# EasyEDA Pro project ProProject_caotai_ctrl_v2.epro

# Schematic schematic1
Create Date: 2023-12-30; Page Name: P1; Project Name: caotai_ctrl_v2; Schematic Name: schematic1; Update Date: 2024-03-09; Company: 嘉立创EDA; Page Size: A4; Version: V1.0
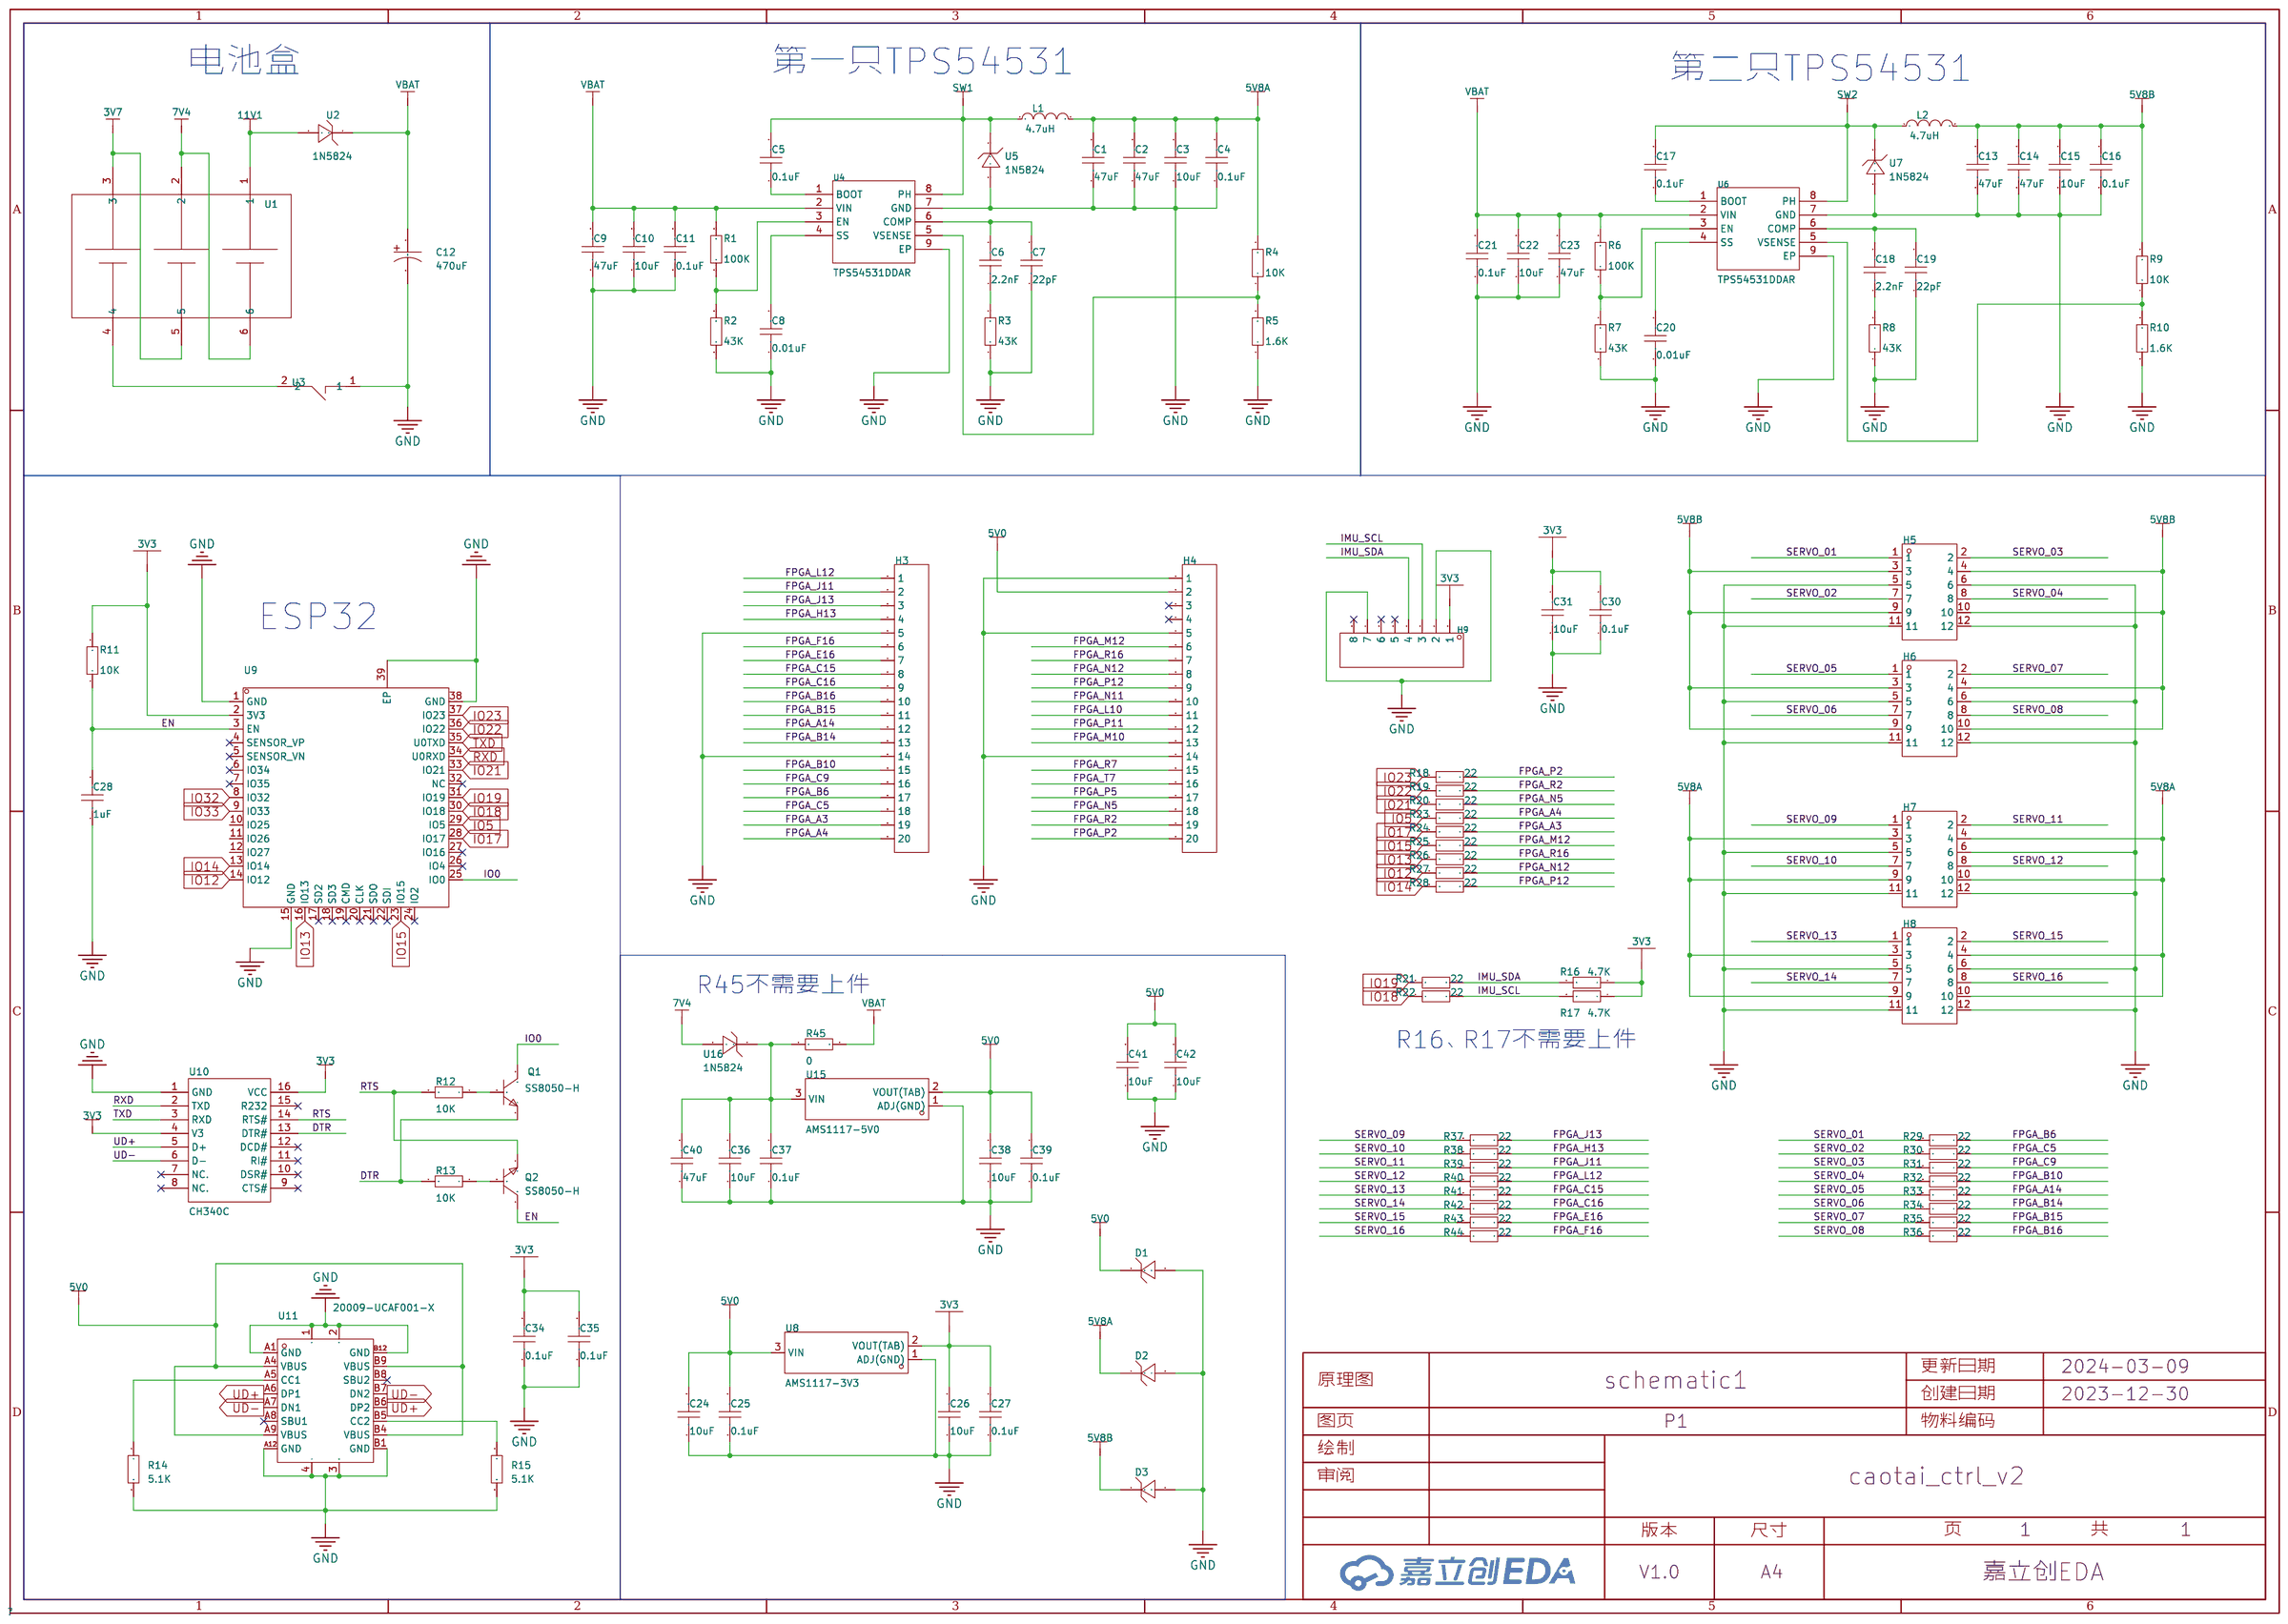
[diagram p0: schematic sheet]

## Parts
C1  47uF  [C0603]
C2  47uF  [C0603]
C3  10uF  [C0603]
C4  0.1uF  [C0603]
C5  0.1uF  [C0603]
C6  2.2nF  [C0603]
C7  22pF  [C0603]
C8  0.01uF  [C0603]
C9  47uF  [C0603]
C10  10uF  [C0603]
C11  0.1uF  [C0603]
C12  470uF  [CAP-TH_BD10.0-P5.00-D1.0-FD]
C13  47uF  [C0603]
C14  47uF  [C0603]
C15  10uF  [C0603]
C16  0.1uF  [C0603]
C17  0.1uF  [C0603]
C18  2.2nF  [C0603]
C19  22pF  [C0603]
C20  0.01uF  [C0603]
C21  0.1uF  [C0603]
C22  10uF  [C0603]
C23  47uF  [C0603]
C24  10uF  [C0603]
C25  0.1uF  [C0603]
C26  10uF  [C0603]
C27  0.1uF  [C0603]
C28  1uF  [C0603]
C30  0.1uF  [C0603]
C31  10uF  [C0603]
C34  0.1uF  [C0603]
C35  0.1uF  [C0603]
C36  10uF  [C0603]
C37  0.1uF  [C0603]
C38  10uF  [C0603]
C39  0.1uF  [C0603]
C40  47uF  [C0603]
C41  10uF  [C0603]
C42  10uF  [C0603]
D1  SMBJ24CD-M3/I  [SMB_L4.6-W3.6-LS5.3-RD]
D2  SMBJ24CD-M3/I  [SMB_L4.6-W3.6-LS5.3-RD]
D3  SMBJ24CD-M3/I  [SMB_L4.6-W3.6-LS5.3-RD]
H3  -  [HDR-TH_20P-P2.54-V-F]
H4  -  [HDR-TH_20P-P2.54-V-F]
H5  -  [HDR-TH_12P-P2.54-V-M-R2-C6-S2.54]
H6  -  [HDR-TH_12P-P2.54-V-M-R2-C6-S2.54]
H7  -  [HDR-TH_12P-P2.54-V-M-R2-C6-S2.54]
H8  -  [HDR-TH_12P-P2.54-V-M-R2-C6-S2.54]
H9  -  [HDR-TH_8P-P2.54-V-M]
L1  4.7uH  [IND-SMD_L10.2-W10.0_MS104R]
L2  4.7uH  [IND-SMD_L10.2-W10.0_MS104R]
Q1  SS8050-H  [SOT-23-3_L2.9-W1.3-P1.90-LS2.4-BR]
Q2  SS8050-H  [SOT-23-3_L2.9-W1.3-P1.90-LS2.4-BR]
R1  100K  [R0603]
R2  43K  [R0603]
R3  43K  [R0603]
R4  10K  [R0603]
R5  1.6K  [R0603]
R6  100K  [R0603]
R7  43K  [R0603]
R8  43K  [R0603]
R9  10K  [R0603]
R10  1.6K  [R0603]
R11  10K  [R0603]
R12  10K  [R0603]
R13  10K  [R0603]
R14  5.1K  [R0603]
R15  5.1K  [R0603]
R16  4.7K  [R0603]
R17  4.7K  [R0603]
R18  22  [R0603]
R19  22  [R0603]
R20  22  [R0603]
R21  22  [R0603]
R22  22  [R0603]
R23  22  [R0603]
R24  22  [R0603]
R25  22  [R0603]
R26  22  [R0603]
R27  22  [R0603]
R28  22  [R0603]
R29  22  [R0603]
R30  22  [R0603]
R31  22  [R0603]
R32  22  [R0603]
R33  22  [R0603]
R34  22  [R0603]
R35  22  [R0603]
R36  22  [R0603]
R37  22  [R0603]
R38  22  [R0603]
R39  22  [R0603]
R40  22  [R0603]
R41  22  [R0603]
R42  22  [R0603]
R43  22  [R0603]
R44  22  [R0603]
R45  0  [R0603]
U1  -  [3节18650插针]
U2  1N5824  [SMB_L4.4-W3.6-LS5.2-RD]
U3  KCD11船型开关  [SW-TH_KCD11]
U4  TPS54531DDAR  [SOIC-8_L5.0-W4.0-P1.27-LS6.0-BL-EP2.0]
U5  1N5824  [SMB_L4.4-W3.6-LS5.2-RD]
U6  TPS54531DDAR  [SOIC-8_L5.0-W4.0-P1.27-LS6.0-BL-EP2.0]
U7  1N5824  [SMB_L4.4-W3.6-LS5.2-RD]
U8  AMS1117-3V3  [SOT-89-3_L4.5-W2.5-P1.50-LS4.1-BL]
U9  -  [wirelm-smd_esp32-s]
U10  CH340C  [SOP-16_L10.0-W3.9-P1.27-LS6.0-BL]
U11  20009-UCAF001-X  [TYPE-C-SMD_20009-UCAF001-X]
U15  AMS1117-5V0  [SOT-89-3_L4.5-W2.5-P1.50-LS4.1-BL]
U16  1N5824  [SMB_L4.4-W3.6-LS5.2-RD]

## Library data of the parts
C1-C11 C13-C28 C30 C31 C34-C42 = CAP_0603: Supplier Footprint: 0603; Check: false
C12 = NXB25VB470M10*16_5.0TP: 容值:470uF;精度:±20%;额定电压:25V;; LCSC Part Name: 470uF ±20% 25V; Supplier Part: C371244; Manufacturer: SAMYOUNG(韩国三莹); Supplier Footprint: 插件,D10xL16mm; JLCPCB Part Class: 扩展库; Datasheet: https://atta.szlcsc.com/upload/public/pdf/source/20190227/C371244_FA85FFEFC2961227CF12E3CCE8C34A7D.pdf; Supplier: LCSC; Tolerance: ±20%; Rated Voltage: 25V; φD: 10mm; L: 16mm; Lead Spacing: 5mm; Lifetime @ Temp: 4000hrs@105℃; Check: false
D1-D3 = SMBJ24CD-M3/I: 极性:双向;反向截止电压(Vrwm):24V;击穿电压(最小值):27.1V;峰值脉冲电流(Ipp)@10/1000μs:-;最大钳位电压:38.4V;峰值脉冲功率(Ppp)@10/1000μs:600W;; LCSC Part Name: 双向 Vrwm:24V 600W; Supplier Part: C335775; Manufacturer: VISHAY(威世); Supplier Footprint: SMBJ; JLCPCB Part Class: 扩展库; Datasheet: https://atta.szlcsc.com/upload/public/pdf/source/20181122/C335775_149570DB14F3A9C7607A2247C4D338E7.pdf; Supplier: LCSC; Polarity: 双向; Reverse Stand-Off Voltage (Vrwm): 24V; Breakdown Voltage (Min): 27.1V; Maximum Clamping Voltage: 38.4V; Peak Pulse Power Dissipation (Ppp)@10/1000μs: 600W; Check: false
H3 H4 = HDR-F_2.54_1x20P: Supplier Part: C50984; Supplier Footprint: 插件; Check: false
H5-H8 = HDR-M_2.54_2x6: Supplier Part: C30734; Supplier Footprint: 插件,P=2.54mm; Check: false
H9 = HDR-M_2.54_1x8P: Supplier Part: C124381; Supplier Footprint: 插件; Check: false
L1 L2 = CDRH104_2: Supplier Part: C9900021916; Supplier Footprint: IND-SMD-2P; JLCPCB Part Class: 扩展库; Supplier: LCSC; Check: false
Q1 Q2 = SS8050-H: 晶体管类型:NPN;集射极击穿电压(Vceo):25V;集电极电流(Ic):1.5A;功率(Pd):300mW;集电极截止电流(Icbo):100nA;集电极-发射极饱和电压(VCE(sat)@Ic,Ib):500mV@800mA,80mA;直流电流增益(hFE@Ic,Vce):200@100mA,1V;特征频率(fT):100MHz;工作温度:-55~+150@(Tj);; LCSC Part Name: NPN25V1.5A; Supplier Part: C699255; Manufacturer: YANGJIE(扬杰); Supplier Footprint: SOT-23-3L; JLCPCB Part Class: 扩展库; Datasheet: https://atta.szlcsc.com/upload/public/pdf/source/20200709/C699255_98BD284548BE18129453A2CE3A1F2C22.pdf; Supplier: LCSC; Transistor Type: NPN; Collector-Emitter Breakdown Voltage (Vceo): 25V; Collector Current (Ic): 1.5A; Power Dissipation (Pd): 300mW; Collector Cut-Off Current (Icbo): 100nA; Collector-Emitter Saturation Voltage (VCE(sat)@Ic,Ib): 500mV@800mA,80mA; DC Current Gain (hFE@Ic,Vce): 200@100mA,1V; Transition Frequency (fT): 100MHz; Operating Temperature: -55~+150@(Tj); Check: false
R1-R45 = Res_0603: Supplier Footprint: 0603; Check: false
U1 = 3节18650电池盒插针: Check: false
U2 U5 U7 U16 = 1N5824-SMB: Supplier Part: C9900006358; Supplier Footprint: SMB; JLCPCB Part Class: 扩展库; Datasheet: https://atta.szlcsc.comnull; Supplier: LCSC; Check: false
U3 = KCD11船型开关: Supplier Part: C9900000872; Supplier Footprint: SW-TH; JLCPCB Part Class: 扩展库; Datasheet: https://atta.szlcsc.comnull; Supplier: LCSC; Check: false
U4 U6 = TPS54531DDAR: 功能类型:降压型;输出类型:可调;输入电压:3.5V~28V;输出电压:800mV~26.04V;输出电流(最大值):5A;; LCSC Part Name: 降压型 输入3.5V~28V 输出800mV~26.04V 5A; Supplier Part: C50605; Manufacturer: TI(德州仪器); Supplier Footprint: SOP-8-EP; JLCPCB Part Class: 扩展库; Datasheet: https://www.ti.com/cn/lit/gpn/tps54531; Supplier: LCSC; Function: 降压型; Synchronous Rectification: 否; Output Type: 可调; Number of Outputs: 1; Topology: 降压式; Input Voltage: 3.5V~28V; Output Voltage: 800mV~26.04V; Output Current (Max): 5A; Switching Frequency: 570kHz; Operating Temperature: -40℃~+85℃@(TA); Check: false
U8 U15 = AMS1117-ADJS: Supplier Part: C3014296; Manufacturer: UMW(广东友台半导体); Supplier Footprint: SOT-89-3; JLCPCB Part Class: 扩展库; Datasheet: https://atta.szlcsc.com/upload/public/pdf/source/20181218/C351450_92F5FFD1D089F5E1CE84AA29B13D48DD.pdf; Supplier: LCSC; Check: false
U9 = esp32-s: LCSC Part Name: ESP32-S; Supplier Part: C277944; Manufacturer: Ai-Thinker(安信可); Manufacturer Part: ESP32-S; Supplier Footprint: SMDModule; JLCPCB Part Class: ExtendedPart; Datasheet: https://atta.szlcsc.com/upload/public/pdf/source/20211217/F4BEA33E732D6002D10DAED85BBCB52B.pdf; Supplier: LCSC; Check: false
U10 = CH340C: 类型:Transceiver;协议类别:USB2.0;驱动器/接收器数:-;数据速率:2Mbps;; Supplier Part: C84681; Manufacturer: WCH(南京沁恒); Supplier Footprint: SOP-16_150mil; JLCPCB Part Class: 扩展库; Datasheet: https://atta.szlcsc.com/upload/public/pdf/source/20200819/C84681_ADBED554CE321879DBD6B1D06488689C.pdf; Supplier: LCSC; Type: Transceiver; Protocol: USB2.0; Data Rate: 2Mbps; Supply Voltage: 3.3V,5V; Check: false
U11 = 20009-UCAF001-X: LCSC Part Name: TYPEC; Supplier Part: C3148200; Manufacturer: MINTRON(明硕); Supplier Footprint: SMD; JLCPCB Part Class: 扩展库; Datasheet: https://atta.szlcsc.com/upload/public/pdf/source/20220705/4C04992B6F70FB490BC74B4779796E6C.pdf; Supplier: LCSC; Check: false

## Nets
3V3: C26.2 C27.2 C30.2 C31.1 C34.2 C35.2 H9.1 R11.2 R16.1 R17.1 U8.2(VOUT(TAB)) U9.2(3V3) U10.4(V3) U10.16(VCC)
3V7: U1.3 U1.5
5V0: C24.2 C25.2 C38.2 C39.2 C41.2 C42.2 D1.1(K) H4.2 U8.3(VIN) U11.A4(VBUS) U11.A9(VBUS) U11.B4(VBUS) U11.B9(VBUS) U15.2(VOUT(TAB))
5V8A: C1.2 C2.2 C3.2 C4.2 D2.1(K) H7.3 H7.4 H7.9 H7.10 H8.3 H8.4 H8.9 H8.10 L1.2 R4.2
5V8B: C13.2 C14.2 C15.2 C16.2 D3.1(K) H5.3 H5.4 H5.9 H5.10 H6.3 H6.4 H6.9 H6.10 L2.2 R9.2
7V4: U1.2 U1.6 U16.2(A)
11V1: U1.1 U2.2(A)
GND: C1.1 C2.1 C3.1 C4.1 C7.1 C8.1 C9.1 C10.1 C11.1 C12.2 C13.1 C14.1 C15.1 C16.1 C19.1 C20.1 C21.1 C22.1 C23.1 C24.1 C25.1 C26.1 C27.1 C28.1 C30.1 C31.2 C34.1 C35.1 C36.1 C37.1 C38.1 C39.1 C40.1 C41.1 C42.1 D1.2(A) D2.2(A) D3.2(A) H3.5 H3.14 H4.1 H4.5 H4.14 H5.5 H5.6 H5.11 H5.12 H6.5 H6.6 H6.11 H6.12 H7.5 H7.6 H7.11 H7.12 H8.5 H8.6 H8.11 H8.12 H9.2 H9.7 R2.1 R3.1 R5.1 R7.1 R8.1 R10.1 R14.2 R15.2 U3.1 U4.7(GND) U4.9(EP) U5.2(A) U6.7(GND) U6.9(EP) U7.2(A) U8.1(ADJ(GND)) U9.1(GND) U9.15(GND) U9.38(GND) U9.39(EP) U10.1(GND) U11.1 U11.2 U11.3 U11.4 U11.A1(GND) U11.A12(GND) U11.B1(GND) U11.B12(GND) U15.1(ADJ(GND))
VBAT: C9.2 C10.2 C11.2 C12.1 C21.2 C22.2 C23.2 R1.2 R6.2 R45.1 U2.1(C) U4.2(VIN) U6.2(VIN)
DTR: Q1.2(E) R13.2 U10.13(DTR#)
EN: C28.2 Q2.3(C) R11.1 U9.3(EN)
FPGA_A3: H3.19 R24.1
FPGA_A4: H3.20 R23.1
FPGA_A14: H3.12 R33.1
FPGA_B6: H3.17 R29.1
FPGA_B10: H3.15 R32.1
FPGA_B14: H3.13 R34.1
FPGA_B15: H3.11 R35.1
FPGA_B16: H3.10 R36.1
FPGA_C5: H3.18 R30.1
FPGA_C9: H3.16 R31.1
FPGA_C15: H3.8 R41.1
FPGA_C16: H3.9 R42.1
FPGA_E16: H3.7 R43.1
FPGA_F16: H3.6 R44.1
FPGA_H13: H3.4 R38.1
FPGA_J11: H3.2 R39.1
FPGA_J13: H3.3 R37.1
FPGA_L10: H4.11
FPGA_L12: H3.1 R40.1
FPGA_M10: H4.13
FPGA_M12: H4.6 R25.1
FPGA_N5: H4.18 R20.1
FPGA_N11: H4.10
FPGA_N12: H4.8 R27.1
FPGA_P2: H4.20 R18.1
FPGA_P5: H4.17
FPGA_P11: H4.12
FPGA_P12: H4.9 R28.1
FPGA_R2: H4.19 R19.1
FPGA_R7: H4.15
FPGA_R16: H4.7 R26.1
FPGA_T7: H4.16
IMU_SCL: H9.3 R17.2 R22.1
IMU_SDA: H9.4 R16.2 R21.1
IO0: Q1.3(C) U9.25(IO0)
IO5: R23.2 U9.29(IO5)
IO12: R27.2 U9.14(IO12)
IO13: R26.2 U9.16(IO13)
IO14: R28.2 U9.13(IO14)
IO15: R25.2 U9.23(IO15)
IO17: R24.2 U9.28(IO17)
IO18: R22.2 U9.30(IO18)
IO19: R21.2 U9.31(IO19)
IO21: R20.2 U9.33(IO21)
IO22: R19.2 U9.36(IO22)
IO23: R18.2 U9.37(IO23)
IO32: U9.8(IO32)
IO33: U9.9(IO33)
RTS: Q2.2(E) R12.2 U10.14(RTS#)
RXD: U9.34(U0RXD) U10.2(TXD)
SERVO_01: H5.1 R29.2
SERVO_02: H5.7 R30.2
SERVO_03: H5.2 R31.2
SERVO_04: H5.8 R32.2
SERVO_05: H6.1 R33.2
SERVO_06: H6.7 R34.2
SERVO_07: H6.2 R35.2
SERVO_08: H6.8 R36.2
SERVO_09: H7.1 R37.2
SERVO_10: H7.7 R38.2
SERVO_11: H7.2 R39.2
SERVO_12: H7.8 R40.2
SERVO_13: H8.1 R41.2
SERVO_14: H8.7 R42.2
SERVO_15: H8.2 R43.2
SERVO_16: H8.8 R44.2
SW1: C5.2 L1.1 U4.8(PH) U5.1(C)
SW2: C17.2 L2.1 U6.8(PH) U7.1(C)
TXD: U9.35(U0TXD) U10.3(RXD)
UD+: U10.5(D+) U11.A6(DP1) U11.B6(DP2)
UD-: U10.6(D-) U11.A7(DN1) U11.B7(DN2)
$1N584: C5.1 U4.1(BOOT)
$1N915: R1.1 R2.2 U4.3(EN)
$1N926: C8.2 U4.4(SS)
$1N1045: C6.2 C7.2 U4.6(COMP)
$1N1051: C6.1 R3.2
$1N1135: R4.1 R5.2 U4.5(VSENSE)
$1N2594: C17.1 U6.1(BOOT)
$1N2596: R6.1 R7.2 U6.3(EN)
$1N2597: C20.2 U6.4(SS)
$1N2600: C18.2 C19.2 U6.6(COMP)
$1N2601: C18.1 R8.2
$1N2603: R9.1 R10.2 U6.5(VSENSE)
$1N3982: Q1.1(B) R12.1
$1N4008: Q2.1(B) R13.1
$1N4343: R14.1 U11.A5(CC1)
$1N4350: R15.1 U11.B5(CC2)
$1N29279: U1.4 U3.2
$1N31260: C36.2 C37.2 C40.2 R45.2 U15.3(VIN) U16.1(C)

Not connected (* = marked no-connect by the designer): H4 3* 4*; H9 5* 6* 8*; U9 4(SENSOR_VP)* 5(SENSOR_VN)* 6(IO34)* 7(IO35)* 10(IO25) 11(IO26) 12(IO27) 17(SD2)* 18(SD3)* 19(CMD)* 20(CLK)* 21(SDO)* 22(SDI)* 24(IO2)* 26(IO4)* 27(IO16)* 32(NC)*; U10 7(NC.)* 8(NC.)* 9(CTS#)* 10(DSR#)* 11(RI#)* 12(DCD#)* 15(R232)*; U11 A8(SBU1)* B8(SBU2)*

## Notes on the sheet
- 电池盒
- 第一只TPS54531
- 第二只TPS54531
- ESP32
- R45不需要上件
- R16、R17不需要上件

# Board PCB1
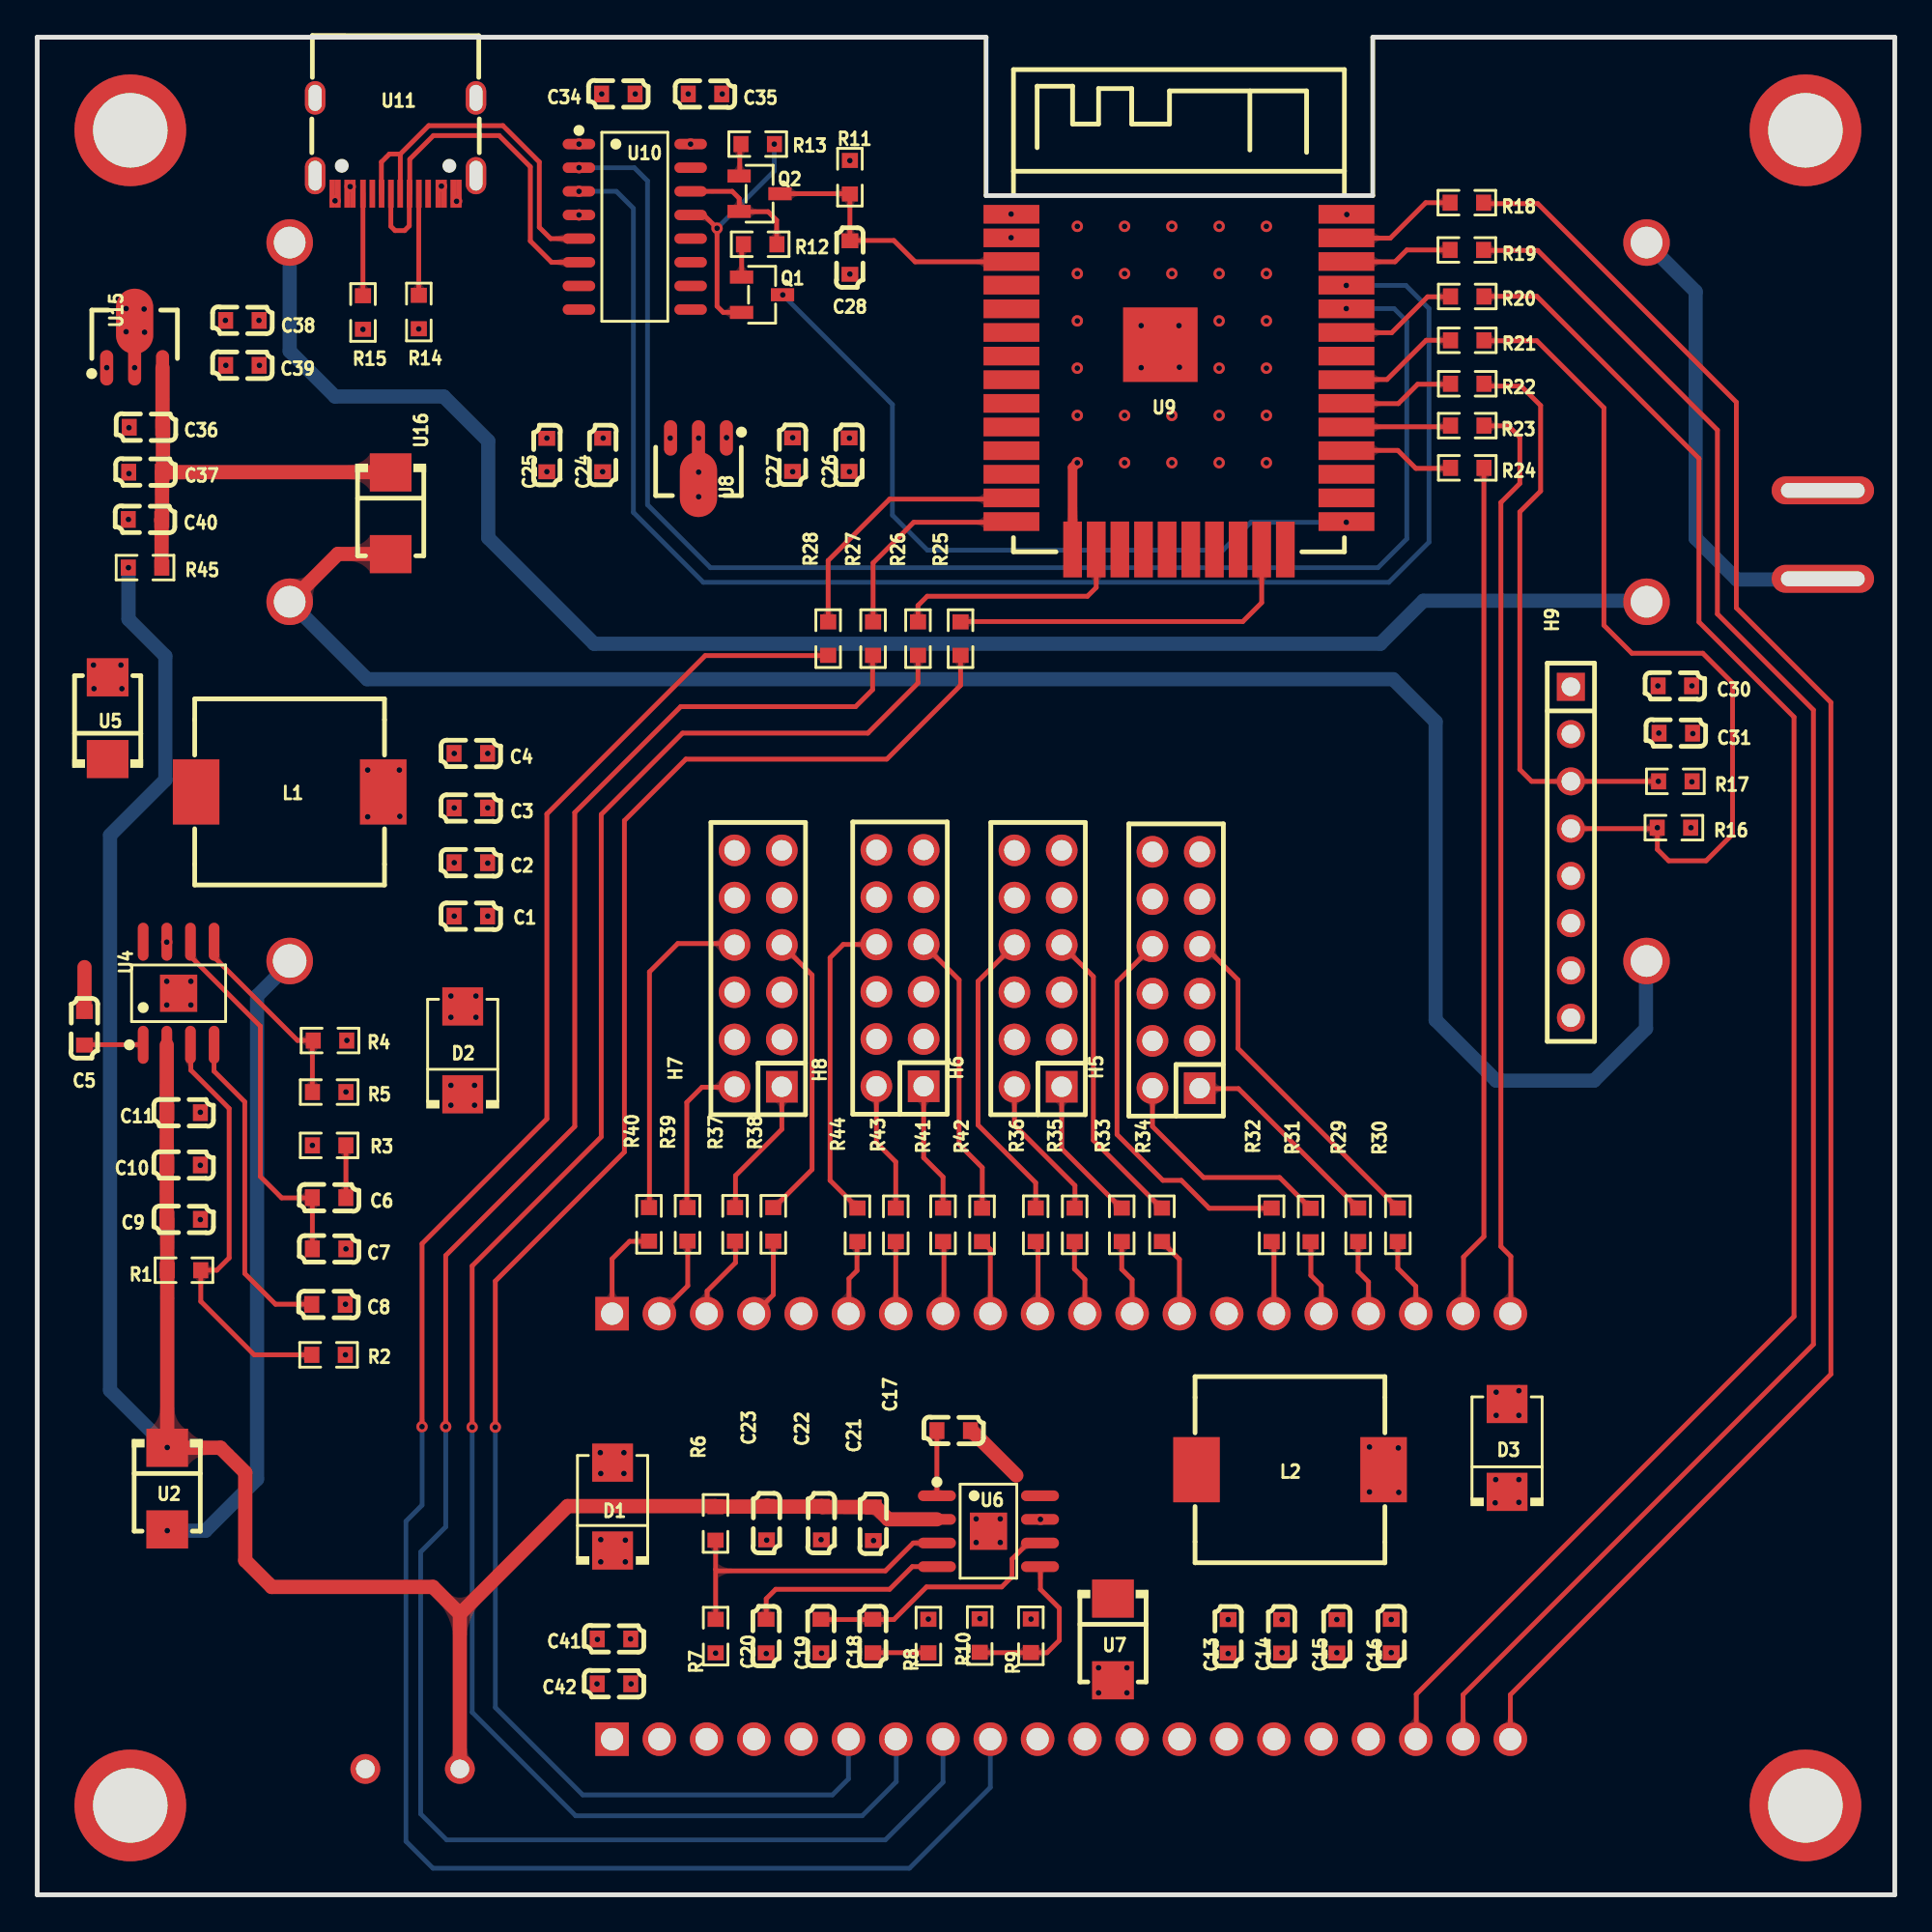
[diagram p1: board, top side]
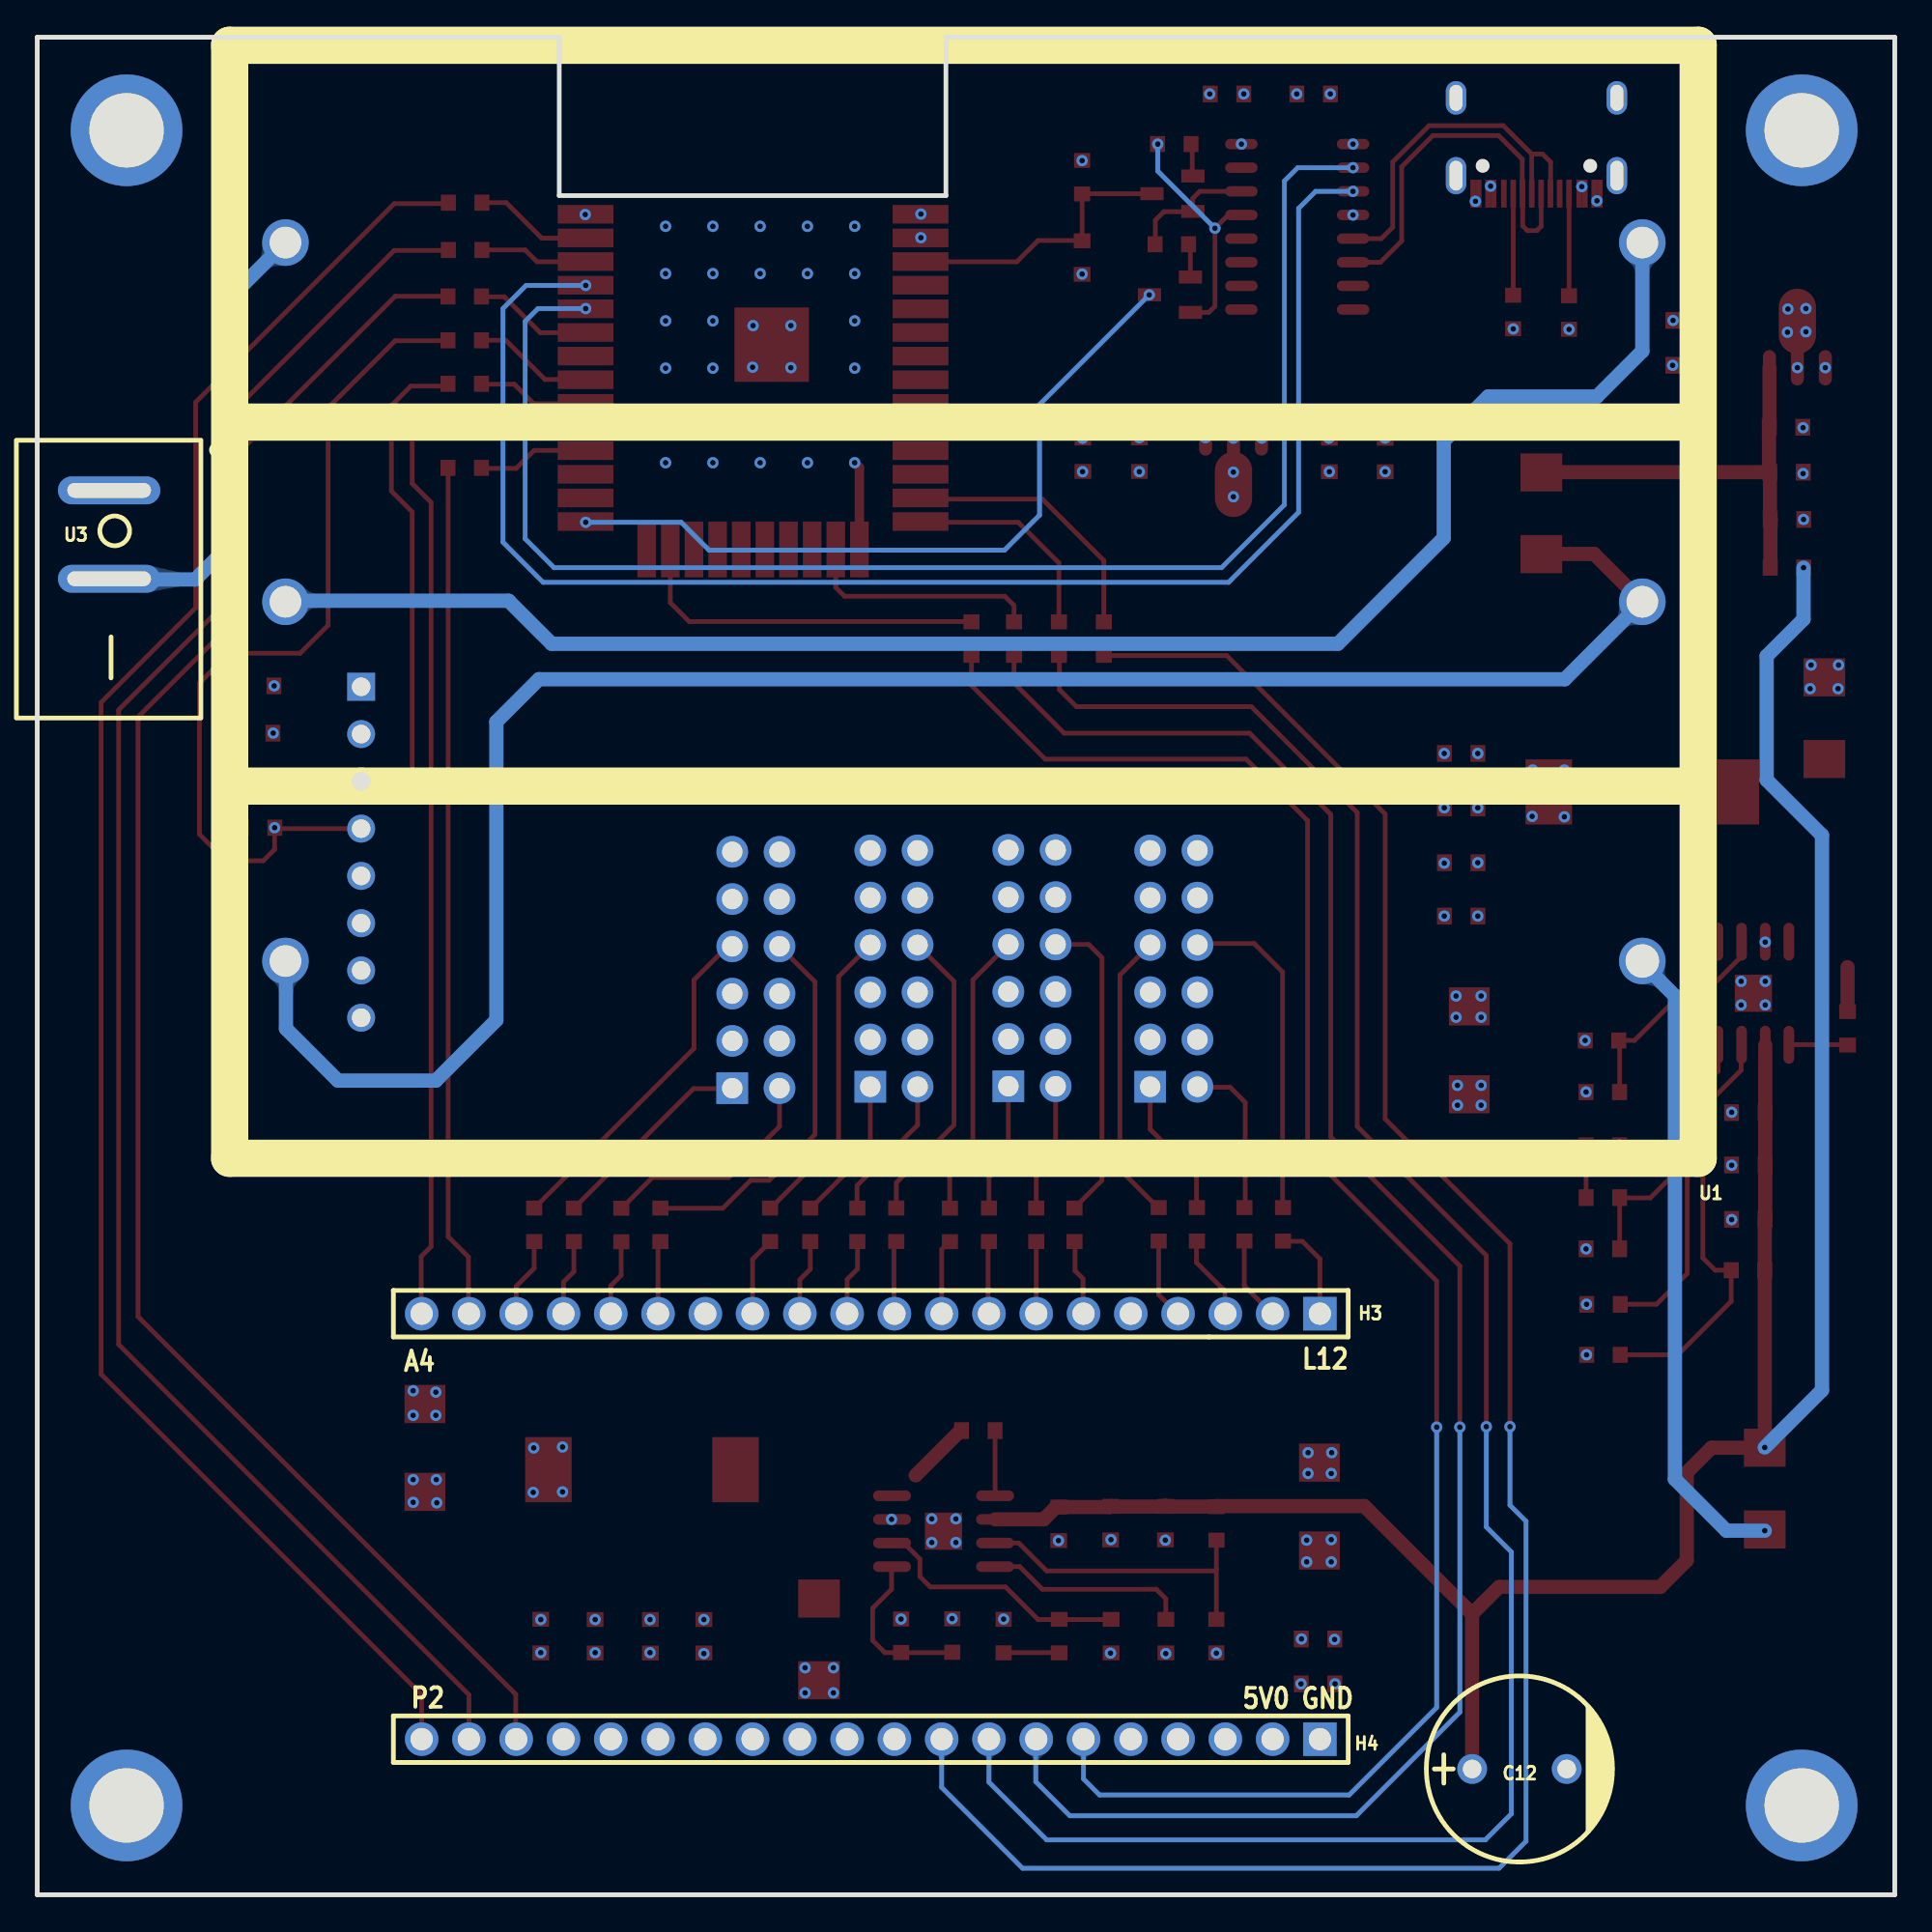
[diagram p2: board, bottom side, seen from below]

Outline 99.8 x 99.8 mm; copper layers: Top Layer, GND, POWER, Bottom Layer. Coordinates in mm from the lower left corner of the outline.
Outline path: 0,99.8 50.98,99.8 50.98,91.29 71.75,91.29 71.75,99.8 99.8,99.8 99.8,0 0,0 0,99.8
Stack: Top Layer 0.035mm 外层铜厚1oz / Dielectric1 0.2104mm 7628 RC49% 8.6mil / GND 0.0152mm 内层铜厚 / Dielectric2 1.065mm 1.1mm H/HOZ 含铜 / POWER 0.0152mm 内层铜厚 / Dielectric3 0.2104mm 7628 RC49% 8.6mil / Bottom Layer 0.035mm 外层铜厚1oz

## Design rules (mm)
template: 自定义配置
spacing copperThickness1oz (default): track to track 0.229, other pairs 0.152 to 0.508
spacing copperThickness2oz: track to track 0.203, other pairs 0.152 to 0.3
track width copperThickness1oz (default): min 0.127, default 0.254, max 2.54
track width copperThickness2oz: min 0.203, default 0.254, max 2.54
track width power_line: min 0.762, default 0.762, max 0.762
differential pair differentialPair (default): width min 0.127, default 0.254, max 2.54; gap min 0.152, default 0.152
via viaSize (default): diameter min 0.5, default 0.61, max 10; hole min 0.3, default 0.305, max 6.299
net VBAT uses power_line
net 5V8A uses power_line
net 11V1 uses power_line
net 7V4 uses power_line
net 3V7 uses power_line
net 5V8B uses power_line
net 5V0 uses power_line
net SW1 uses power_line
net SW2 uses power_line

## Placement (name value [footprint] x y rotation side)
C1  47uF  [C0603]  23.3 52.58 180 top
C2  47uF  [C0603]  23.3 55.45 180 top
C3  10uF  [C0603]  23.3 58.39 180 top
C4  0.1uF  [C0603]  23.3 61.32 180 top
C5  0.1uF  [C0603]  2.54 46.55 90 top
C6  2.2nF  [C0603]  15.68 37.45 180 top
C7  22pF  [C0603]  15.68 34.7 180 top
C8  0.01uF  [C0603]  15.65 31.72 180 top
C9  47uF  [C0603]  7.87 36.29 180 top
C10  10uF  [C0603]  7.87 39.21 180 top
C11  0.1uF  [C0603]  7.87 42.02 180 top
C12  470uF  [CAP-TH_BD10.0-P5.00-D1.0-FD]  20.17 6.76 180 bottom
C13  47uF  [C0603]  63.98 13.89 90 top
C14  47uF  [C0603]  66.85 13.89 90 top
C15  10uF  [C0603]  69.83 13.89 90 top
C16  0.1uF  [C0603]  72.75 13.9 90 top
C17  0.1uF  [C0603]  49.24 24.94 0 top
C18  2.2nF  [C0603]  44.9 13.9 90 top
C19  22pF  [C0603]  42.1 13.9 90 top
C20  0.01uF  [C0603]  39.16 13.9 90 top
C21  0.1uF  [C0603]  44.92 19.93 90 top
C22  10uF  [C0603]  42.13 19.97 90 top
C23  47uF  [C0603]  39.19 19.97 90 top
C24  10uF  [C0603]  30.38 77.36 270 top
C25  0.1uF  [C0603]  27.38 77.35 270 top
C26  10uF  [C0603]  43.62 77.37 90 top
C27  0.1uF  [C0603]  40.58 77.37 90 top
C28  1uF  [C0603]  43.66 87.96 90 top
C30  0.1uF  [C0603]  87.99 64.95 180 top
C31  10uF  [C0603]  88.04 62.41 0 top
C34  0.1uF  [C0603]  31.22 96.75 0 top
C35  0.1uF  [C0603]  35.88 96.75 180 top
C36  10uF  [C0603]  5.84 78.85 0 top
C37  0.1uF  [C0603]  5.82 76.43 0 top
C38  10uF  [C0603]  11.02 84.59 0 top
C39  0.1uF  [C0603]  11.02 82.17 0 top
C40  47uF  [C0603]  5.79 73.89 0 top
C41  10uF  [C0603]  30.99 13.75 0 top
C42  10uF  [C0603]  30.99 11.33 0 top
D1  SMBJ24CD-M3/I  [SMB_L4.6-W3.6-LS5.3-RD]  30.91 20.86 90 top
D2  SMBJ24CD-M3/I  [SMB_L4.6-W3.6-LS5.3-RD]  22.86 45.37 90 top
D3  SMBJ24CD-M3/I  [SMB_L4.6-W3.6-LS5.3-RD]  78.97 24.01 90 top
H3  -  [HDR-TH_20P-P2.54-V-F]  55.02 31.22 0 bottom
H4  -  [HDR-TH_20P-P2.54-V-F]  55.02 8.36 0 bottom
H5  -  [HDR-TH_12P-P2.54-V-M-R2-C6-S2.54]  61.19 49.69 90 top
H6  -  [HDR-TH_12P-P2.54-V-M-R2-C6-S2.54]  53.77 49.76 90 top
H7  -  [HDR-TH_12P-P2.54-V-M-R2-C6-S2.54]  38.74 49.76 90 top
H8  -  [HDR-TH_12P-P2.54-V-M-R2-C6-S2.54]  46.35 49.79 90 top
H9  -  [HDR-TH_8P-P2.54-V-M]  82.4 56.01 270 top
L1  4.7uH  [IND-SMD_L10.2-W10.0_MS104R]  13.56 59.25 0 top
L2  4.7uH  [IND-SMD_L10.2-W10.0_MS104R]  67.31 22.84 0 top
NOREF  -  [Pad_e74]  95 4.8 0 top
NOREF#2  -  [Pad_e73]  5 4.8 0 top
NOREF#3  -  [Pad_e72]  95 94.8 0 top
NOREF#4  -  [Pad_e68]  5 94.8 0 top
Q1  SS8050-H  [SOT-23-3_L2.9-W1.3-P1.90-LS2.4-BR]  38.94 85.96 180 top
Q2  SS8050-H  [SOT-23-3_L2.9-W1.3-P1.90-LS2.4-BR]  38.81 91.39 180 top
R1  100K  [R0603]  7.88 33.56 180 top
R2  43K  [R0603]  15.65 29.01 180 top
R3  43K  [R0603]  15.69 40.26 0 top
R4  10K  [R0603]  15.73 45.9 0 top
R5  1.6K  [R0603]  15.69 43.13 180 top
R6  100K  [R0603]  36.44 19.95 90 top
R7  43K  [R0603]  36.45 13.9 90 top
R8  43K  [R0603]  47.88 13.9 270 top
R9  10K  [R0603]  53.39 13.92 90 top
R10  1.6K  [R0603]  50.64 13.93 270 top
R11  10K  [R0603]  43.66 92.28 90 top
R12  10K  [R0603]  38.84 88.68 0 top
R13  10K  [R0603]  38.71 94.06 0 top
R14  5.1K  [R0603]  20.5 85.04 270 top
R15  5.1K  [R0603]  17.5 85.01 270 top
R16  4.7K  [R0603]  87.94 57.33 180 top
R17  4.7K  [R0603]  88.01 59.82 180 top
R18  22  [R0603]  76.81 90.91 180 top
R19  22  [R0603]  76.81 88.37 180 top
R20  22  [R0603]  76.83 85.87 180 top
R21  22  [R0603]  76.83 83.52 180 top
R22  22  [R0603]  76.83 81.18 180 top
R23  22  [R0603]  76.83 78.93 180 top
R24  22  [R0603]  76.83 76.66 180 top
R25  22  [R0603]  49.61 67.49 90 top
R26  22  [R0603]  47.32 67.49 90 top
R27  22  [R0603]  44.91 67.49 90 top
R28  22  [R0603]  42.49 67.49 90 top
R29  22  [R0603]  70.97 36 90 top
R30  22  [R0603]  73.1 36 90 top
R31  22  [R0603]  68.42 35.99 90 top
R32  22  [R0603]  66.32 36 90 top
R33  22  [R0603]  58.27 36 90 top
R34  22  [R0603]  60.43 36 90 top
R35  22  [R0603]  55.74 36 90 top
R36  22  [R0603]  53.65 36 90 top
R37  22  [R0603]  37.49 36.02 90 top
R38  22  [R0603]  39.55 36.02 90 top
R39  22  [R0603]  34.94 36.02 90 top
R40  22  [R0603]  32.87 36.02 90 top
R41  22  [R0603]  48.67 36 90 top
R42  22  [R0603]  50.76 35.99 90 top
R43  22  [R0603]  46.13 36 90 top
R44  22  [R0603]  44.07 36 90 top
R45  0  [R0603]  5.79 71.31 0 top
U1  -  [3节18650插针]  13.56 50.17 0 bottom
U2  1N5824  [SMB_L4.4-W3.6-LS5.2-RD]  6.98 21.82 270 top
U3  KCD11船型开关  [SW-TH_KCD11]  95.94 73.08 270 bottom
U4  TPS54531DDAR  [SOIC-8_L5.0-W4.0-P1.27-LS6.0-BL-EP2.0]  7.6 48.44 0 top
U5  1N5824  [SMB_L4.4-W3.6-LS5.2-RD]  3.78 63.21 90 top
U6  TPS54531DDAR  [SOIC-8_L5.0-W4.0-P1.27-LS6.0-BL-EP2.0]  51.11 19.53 270 top
U7  1N5824  [SMB_L4.4-W3.6-LS5.2-RD]  57.8 13.72 270 top
U8  AMS1117-3V3  [SOT-89-3_L4.5-W2.5-P1.50-LS4.1-BL]  35.53 77.02 180 top
U9  -  [wirelm-smd_esp32-s]  61.34 81.28 0 top
U10  CH340C  [SOP-16_L10.0-W3.9-P1.27-LS6.0-BL]  32.11 89.61 270 top
U11  20009-UCAF001-X  [TYPE-C-SMD_20009-UCAF001-X]  19.25 93.97 180 top
U15  AMS1117-5V0  [SOT-89-3_L4.5-W2.5-P1.50-LS4.1-BL]  5.23 83.29 0 top
U16  1N5824  [SMB_L4.4-W3.6-LS5.2-RD]  18.99 74.22 270 top

## Footprints (pads in the part's own frame, mm; a bottom-side part is the same pattern mirrored in y, then rotated)
3节18650插针
  round 2.5 hole 1.8x1.7: 1(0,0)
  round 2.5 hole 1.7: 2(0,-19.3) 3(0,-38.6) 4(72.9,-38.6) 5(72.9,-19.3) 6(72.9,0)
C0603
  rect 0.8x0.9 smd: 1(-0.9,0) 2(0.9,0)
CAP-TH_BD10.0-P5.00-D1.0-FD
  round 1.6 hole 1: 1(-2.54,0) 2(2.54,0)
HDR-TH_8P-P2.54-V-M
  rect 1.5x1.5 hole 1: 1(-8.89,0)
  round 1.5 hole 1: 2(-6.35,0) 3(-3.81,0) 4(-1.27,0) 5(1.27,0) 6(3.81,0) 7(6.35,0) 8(8.89,0)
HDR-TH_12P-P2.54-V-M-R2-C6-S2.54
  rect 1.7x1.7 hole 1.1: 1(-6.35,-1.27)
  round 1.7 hole 1.1: 2(-6.35,1.27) 3(-3.81,-1.27) 4(-3.81,1.27) 5(-1.27,-1.27) 6(-1.27,1.27) 7(1.27,-1.27) 8(1.27,1.27) 9(3.81,-1.27) 10(3.81,1.27) 11(6.35,-1.27) 12(6.35,1.27)
HDR-TH_20P-P2.54-V-F
  rect 1.8x1.8 hole 1.2: 1(-24.13,0)
  round 1.8 hole 1.2: 2(-21.59,0) 3(-19.05,0) 4(-16.51,0) 5(-13.97,0) 6(-11.43,0) 7(-8.89,0) 8(-6.35,0) 9(-3.81,0) 10(-1.27,0) 11(1.27,0) 12(3.81,0) 13(6.35,0) 14(8.89,0) 15(11.43,0) 16(13.97,0) 17(16.51,0) 18(19.05,0) 19(21.59,0) 20(24.13,0)
IND-SMD_L10.2-W10.0_MS104R
  rect 2.5x3.5 smd: 1(-5.026,0) 2(5.026,0)
Pad_e68
  round 6 hole 4: 40(0,0)
Pad_e72
  round 6 hole 4: 40(0,0)
Pad_e73
  round 6 hole 4: 40(0,0)
Pad_e74
  round 6 hole 4: 40(0,0)
R0603
  rect 0.806x0.864 smd: 1(-0.9,0) 2(0.9,0)
SMB_L4.4-W3.6-LS5.2-RD
  rect 2.047x2.241 smd: 1(-2.195,0) 2(2.195,0)
SMB_L4.6-W3.6-LS5.3-RD
  rect 2.047x2.192 smd: 1(-2.361,0) 2(2.361,0)
SOIC-8_L5.0-W4.0-P1.27-LS6.0-BL-EP2.0
  oval 0.574x2.038 smd: 1(-1.905,-2.769) 2(-0.635,-2.769) 3(0.635,-2.769) 4(1.905,-2.769) 5(1.905,2.769) 6(0.635,2.769) 7(-0.635,2.769) 8(-1.905,2.769)
  rect 2x2 smd: 9(0,0)
SOP-16_L10.0-W3.9-P1.27-LS6.0-BL
  oval 0.56x1.745 smd: 1(-4.445,-3) 2(-3.175,-3) 3(-1.905,-3) 4(-0.635,-3) 5(0.635,-3) 6(1.905,-3) 7(3.175,-3) 8(4.445,-3) 9(4.445,3) 10(3.175,3) 11(1.905,3) 12(0.635,3) 13(-0.635,3) 14(-1.905,3) 15(-3.175,3) 16(-4.445,3)
SOT-23-3_L2.9-W1.3-P1.90-LS2.4-BR
  rect 1.25x0.7 smd: 1(1.1,-0.95) 2(1.1,0.95) 3(-1.1,0)
SOT-89-3_L4.5-W2.5-P1.50-LS4.1-BL
  oval 0.7x1.9 smd: 1(-1.501,-1.25) 3(1.501,-1.25)
  oval 2x3.5 smd: 2(0,1.25)
  oval 0.7x2.1 smd: 2(0,-1.151)
SW-TH_KCD11
  oval 1.5x5.5 hole 0.8x4.5: 1(-2.375,0) 2(2.375,0)
TYPE-C-SMD_20009-UCAF001-X
  oval 1.1x2 hole 0.7x1.6: 1(-4.32,1.606) 2(4.32,1.606)
  oval 1.1x1.8 hole 0.7x1.4: 3(4.32,-2.574) 4(-4.32,-2.574)
  rect 0.3x1.5 smd: A1(-3.4,2.573) A4(-2.6,2.573) A5(-1.25,2.573) A6(-0.25,2.573) A7(0.25,2.573) A8(1.25,2.574) A9(2.6,2.574) A12(3.4,2.573) B1(3.1,2.573) B4(2.3,2.574) B5(1.75,2.573) B6(0.75,2.573) B7(-0.75,2.573) B8(-1.75,2.574) B9(-2.3,2.573) B12(-3.1,2.573)
wirelm-smd_esp32-s
  rect 2.999x1.001 smd: 1(-8.999,9.005) 2(-8.999,7.734) 3(-8.999,6.465) 4(-8.999,5.194) 5(-8.999,3.925) 6(-8.999,2.655) 7(-8.999,1.385) 8(-8.999,0.115) 9(-8.999,-1.155) 10(-8.999,-2.425) 11(-8.999,-3.696) 12(-8.999,-4.965) 13(-8.999,-6.236) 14(-8.999,-7.505) 25(8.999,-7.505) 26(8.999,-6.236) 27(8.999,-4.965) 28(8.999,-3.696) 29(8.999,-2.425) 30(8.999,-1.155) 31(8.999,0.115) 32(8.999,1.385) 33(8.999,2.655) 34(8.999,3.925) 35(8.999,5.194) 36(8.999,6.465) 37(8.999,7.734) 38(8.999,9.005)
  rect 1.001x2.999 smd: 15(-5.715,-9.005) 16(-4.445,-9.005) 17(-3.175,-9.005) 18(-1.905,-9.005) 19(-0.635,-9.005) 20(0.635,-9.005) 21(1.905,-9.005) 22(3.175,-9.005) 23(4.445,-9.005) 24(5.715,-9.005)
  rect 4x4 smd: 39(-1.001,1.996)

## Nets
As in the schematic, except:
GND: C1.1 C2.1 C3.1 C4.1 C7.1 C8.1 C9.1 C10.1 C11.1 C12.2 C13.1 C14.1 C15.1 C16.1 C19.1 C20.1 C21.1 C22.1 C23.1 C24.1 C25.1 C26.1 C27.1 C28.1 C30.1 C31.2 C34.1 C35.1 C36.1 C37.1 C38.1 C39.1 C40.1 C41.1 C42.1 D1.2 D2.2 D3.2 H3.5 H3.14 H4.1 H4.5 H4.14 H5.5 H5.6 H5.11 H5.12 H6.5 H6.6 H6.11 H6.12 H7.5 H7.6 H7.11 H7.12 H8.5 H8.6 H8.11 H8.12 H9.2 H9.7 NOREF.40 NOREF#2.40 NOREF#3.40 NOREF#4.40 R2.1 R3.1 R5.1 R7.1 R8.1 R10.1 R14.2 R15.2 U3.1 U4.7 U4.9 U5.2 U6.7 U6.9 U7.2 U8.1 U9.1 U9.15 U9.38 U9.39 U10.1 U11.1 U11.2 U11.3 U11.4 U11.A1 U11.A12 U11.B1 U11.B12 U15.1

Pads without a net: H4 3 4; H9 5 6 8; U9 4 5 6 7 10 11 12 17 18 19 20 21 22 24 26 27 32; U10 7 8 9 10 11 12 15; U11 A8 B8

## Via types
v1: diameter 0.61, hole 0.305, Top Layer to Bottom Layer, 185 vias

## Routing (per net, layer and track width the routed paths; a pad name or vN(x,y) marks a point on that pad's centre or on a via; arc(x,y) is an arc through that point)
3V3:
  vias: v1(29.11,90.25) v1(32.13,96.75) v1(34.98,96.75) v1(35.1,94.06) v1(35.53,78.26) v1(35.53,76.43) v1(35.53,75.11) v1(40.59,78.29) v1(43.64,78.26) v1(43.66,93.17) v1(52.32,89.03) v1(87.07,64.95) v1(87.12,62.41) v1(88.85,57.33) v1(88.9,59.8)
3V7: length 89.2
  Bottom Layer w0.762: 13.56,88.78 13.56,82.93 16,80.5 21.84,80.5 24.23,78.11 24.23,72.9 29.92,67.21 72.16,67.21 74.47,69.52 86.36,69.52 86.41,69.47
5V0:
  vias: v1(4.78,85.22) v1(4.78,83.98) v1(5.23,82.05) v1(5.74,85.2) v1(5.77,83.95) v1(11.91,84.59) v1(11.94,82.17) v1(16.81,91.77) v1(21.72,91.8) v1(27.38,76.46) v1(30.28,19.08) v1(30.28,17.89) v1(30.38,76.46) v1(31.6,19.05) v1(31.6,17.89) v1(31.88,13.75) v1(31.9,11.33) v1(34.01,78.26)
5V8A:
  vias: v1(16.64,45.9) v1(17.75,60.43) v1(17.75,57.92) v1(19.46,60.43) v1(19.48,57.94) v1(22.22,43.49) v1(22.22,42.42) v1(22.4,61.32) v1(22.4,58.4) v1(22.4,55.45) v1(22.4,52.58) v1(23.5,43.49) v1(23.5,42.42)
5V8B:
  vias: v1(53.39,14.81) v1(63.98,14.79) v1(66.88,14.79) v1(69.82,14.79) v1(71.58,24.06) v1(71.58,21.64) v1(72.75,14.79) v1(73.13,24.01) v1(73.15,21.62) v1(78.33,21.06) v1(78.36,22.3) v1(79.6,22.3) v1(79.6,21.09)
7V4: length 104.1
  Top Layer w0.762: 19,72.04 16.15,72.04 13.61,69.5
  Bottom Layer w0.762: 13.59,69.45 17.73,65.31 72.85,65.31 75.13,63.02 75.13,46.99 78.38,43.74 83.64,43.74 86.44,46.54 86.44,50.07 86.51,50.14
11V1: length 34.5
  Bottom Layer w0.762: 13.54,50.17 13.54,50.02 11.81,48.29 11.81,22.33 9.04,19.56 v1(6.98,19.56)
GND: length 4.8
  Top Layer w0.508: v1(55.88,76.94) 55.63,76.69 55.63,72.29
  vias: v1(3.02,66.07) v1(3.05,64.8) v1(3.73,82.05) v1(4.5,66.07) v1(4.55,64.8) v1(4.93,78.82) v1(4.93,76.36) v1(4.9,73.89) v1(6.96,51.18) v1(6.96,49.08) v1(6.96,47.81) v1(8.25,49.08) v1(8.25,47.81) v1(8.76,42.04) v1(8.76,39.2) v1(8.76,36.27) v1(10.11,84.59) v1(10.13,82.17) v1(14.78,40.26) v1(16,91.01) v1(16.59,43.13) v1(16.59,34.7) v1(16.56,31.73) v1(16.56,29.01) v1(17.5,84.1) v1(20.5,84.13) v1(22.22,48.29) v1(22.22,47.15) v1(22.53,90.99) v1(23.57,48.29) v1(23.57,47.15) v1(24.21,61.32) v1(24.21,58.4) v1(24.21,55.43) v1(24.21,52.58) v1(27.38,78.26) v1(29.11,94.06) v1(30.1,13.72) v1(30.07,11.33) v1(30.33,96.75) v1(30.25,23.75) v1(30.28,22.64) v1(30.4,78.26) v1(31.52,23.75) v1(31.52,22.64) v1(36.45,12.98) v1(36.8,96.75) v1(37.03,78.29) v1(39.19,19.05) v1(39.17,12.96) v1(40.59,76.46) v1(42.11,19.08) v1(42.14,12.98) v1(43.64,76.46) v1(43.66,87.07) v1(44.93,19.03) v1(47.88,14.81) v1(50.44,20.2) v1(50.44,18.93) v1(50.65,14.84) v1(51.74,20.2) v1(51.74,18.93) v1(52.32,90.3) v1(53.9,20.17) v1(55.88,89.64) v1(55.88,87.1) v1(55.88,84.56) v1(55.88,82.02) v1(55.88,79.48) v1(57.02,12.2) v1(57.02,10.85) v1(58.42,89.64) v1(58.42,87.1) v1(58.42,79.48) v1(58.42,76.94) v1(58.55,12.2) v1(58.55,10.85) v1(59.31,84.31) v1(59.31,82.05) v1(60.96,89.64) v1(60.96,87.1) v1(60.96,79.48) v1(60.96,76.94) v1(61.34,84.31) v1(61.37,82.07) v1(63.5,89.64) v1(63.5,87.1) v1(63.5,84.56) v1(63.5,82.02) v1(63.5,79.48) v1(63.5,76.94) v1(63.98,12.96) v1(66.04,89.64) v1(66.04,87.1) v1(66.04,84.56) v1(66.04,82.02) v1(66.04,79.48) v1(66.04,76.94) v1(66.88,13.01) v1(69.82,13.01) v1(70.36,90.28) v1(72.75,13.01) v1(78.38,27) v1(78.38,25.76) v1(79.6,27.08) v1(79.6,25.76) v1(88.9,64.95) v1(88.95,62.39)
VBAT: length 131.1
  Top Layer w0.762: 39.17,20.86 36.45,20.86 36.42,20.88 28.5,20.88 22.71,15.09 ; 39.17,20.86 42.11,20.86 42.14,20.88 42.19,20.83 45.06,20.83 45.72,20.17 48.34,20.17 ; 39.17,20.86 39.22,20.91 ; 22.71,15.09 21.26,16.54 12.6,16.54 11.18,17.96 11.18,22.69 9.84,24.02 U2.1 R1.2 ; 22.71,15.09 C12.1 ; 6.98,33.58 6.98,36.27 ; 6.96,45.65 6.96,36.3
  Bottom Layer w0.762: v1(4.9,71.3) 4.9,68.53 6.88,66.55 6.88,59.9 3.91,56.93 3.91,27.11 v1(6.98,24.03)
DTR: length 13.2
  Top Layer w0.254: 37.87,85.02 36.86,85.02 36.53,85.35 v1(36.53,89.54) 35.81,90.25 35.1,90.25
  Bottom Layer w0.254: v1(36.53,89.54) 39.6,92.61 v1(39.6,94.06) ; 39.62,94.06 39.62,94.03 39.65,94.01
EN: length 15.4
  Top Layer w0.254: 39.95,91.39 43.66,91.39 ; 43.66,91.39 43.66,88.88 46.03,88.88 47.17,87.74 52.35,87.74 ; 43.66,91.39 43.69,91.37
FPGA_A3: length 45.9
  Top Layer w0.254: 76.61,31.19 76.63,31.22 76.63,34.27 77.72,35.36 77.72,76.66
FPGA_A4: length 50
  Top Layer w0.254: 77.72,78.92 79.04,78.92 79.65,78.31 79.65,75.82 78.64,74.81 78.64,34.83 79.17,34.29 79.17,31.22 79.12,31.17
FPGA_A14: length 4.1
  Top Layer w0.254: 58.83,31.25 58.83,33.05 58.27,33.61 58.27,35.11
FPGA_B6: length 4.1
  Top Layer w0.254: 70.97,35.06 70.97,33.48 71.53,32.92 71.53,31.19
FPGA_B10: length 3.9
  Top Layer w0.254: 66.45,31.25 66.45,34.95 66.32,35.08
FPGA_B14: length 4.3
  Top Layer w0.254: 61.37,31.19 61.37,34.14 60.43,35.08
FPGA_B15: length 4.1
  Top Layer w0.254: 55.73,35.08 55.73,33.62 56.29,33.06 56.29,31.25
FPGA_B16: length 3.9
  Top Layer w0.254: 53.65,35.08 53.77,34.95 53.77,31.25 H3.10
FPGA_C5: length 4.3
  Top Layer w0.254: 73.1,35.08 73.1,33.66 74.07,32.69 74.07,31.19
FPGA_C9: length 4.1
  Top Layer w0.254: H3.16 68.99,32.72 68.43,33.28 68.43,35.08
FPGA_C15: length 3.9
  Top Layer w0.254: 48.67,31.19 48.72,31.24 48.72,35.03 48.67,35.08
FPGA_C16: length 4.1
  Top Layer w0.254: 50.77,35.11 51.21,34.67 H3.9
FPGA_E16: length 3.9
  Top Layer w0.254: H3.7 46.13,35.08
FPGA_F16: length 4.1
  Top Layer w0.254: 44.07,35.06 44.04,35.03 44.04,33.53 43.61,33.1 43.61,31.17
FPGA_H13: length 4.3
  Top Layer w0.254: 38.53,31.22 39.55,32.24 39.55,35.13
FPGA_J11: length 4.5
  Top Layer w0.254: 34.95,35.13 34.95,32.72 33.45,31.22
FPGA_J13: length 4.5
  Top Layer w0.254: 37.52,35.13 37.52,33.96 35.99,32.44 35.99,31.22
FPGA_L12: length 5.3
  Top Layer w0.254: 32.87,35.13 32.84,35.11 31.83,35.11 30.89,34.17 30.89,31.25
FPGA_M12: length 96.6
  Top Layer w0.254: 49.61,66.58 49.61,64.98 45.64,61.01 34.85,61.01 31.55,57.71 31.55,39.91 24.61,32.97 v1(24.61,25.12)
  Bottom Layer w0.254: H4.6 43.59,6.23 42.72,5.36 29.31,5.36 24.61,10.06 v1(24.61,25.12)
FPGA_N5: length 94.4
  Top Layer w0.254: 77.75,85.88 80.57,85.88 89.28,77.17 89.28,68.38 94.39,63.28 94.39,31.07 74.09,10.77 74.09,8.46 74.04,8.41
FPGA_N12: length 110
  Top Layer w0.254: 21.95,25.18 21.95,34.34 28.88,41.28 28.88,58.14 34.57,63.83 43.97,63.83 44.88,64.75 44.88,66.55
  Bottom Layer w0.254: H4.8 48.67,6.05 45.57,2.95 22,2.95 20.6,4.35 20.6,18.42 21.95,19.76 v1(21.95,25.15)
FPGA_P2: length 99.1
  Top Layer w0.254: 77.7,90.91 77.75,90.86 80.62,90.86 91.29,80.19 91.29,69.14 96.37,64.06 96.37,27.97 79.15,10.75 H4.20
FPGA_P12: length 113.3
  Top Layer w0.254: 20.68,25.18 20.68,34.98 27.38,41.69 27.38,58.07 35.89,66.58 42.49,66.58
  Bottom Layer w0.254: H4.9 51.21,5.77 46.86,1.43 21.26,1.43 19.81,2.87 19.81,20.07 20.68,20.93 v1(20.68,25.15)
FPGA_R2: length 96.9
  Top Layer w0.254: 76.61,8.31 76.61,10.75 95.43,29.57 95.43,63.66 90.27,68.81 90.27,78.69 80.62,88.34 77.75,88.34 77.72,88.37
FPGA_R16: length 100.7
  Top Layer w0.254: v1(23.37,25.12) 23.37,33.79 30.3,40.72 30.3,58.04 34.67,62.41 44.63,62.41 47.32,65.1 47.32,66.6
  Bottom Layer w0.254: 46.15,8.33 46.15,6.07 44.32,4.25 28.93,4.25 23.37,9.81 v1(23.37,25.12)
IMU_SCL: length 31.2
  Top Layer w0.254: 77.75,81.06 79.73,81.06 80.77,80.01 80.77,75.42 79.65,74.3 79.65,60.46 80.29,59.82 H9.3 ; 82.42,59.82 v1(87.1,59.82)
IMU_SDA: length 46.6
  Top Layer w0.254: 77.72,83.49 80.57,83.49 84.17,79.89 84.17,68.21 85.67,66.7 89.48,66.7 91.08,65.1 91.08,56.98 89.66,55.55 87.66,55.55 87.05,56.16 v1(87.05,57.33) 87,57.28 82.42,57.28
IO0: length 40.1
  Bottom Layer w0.254: v1(40.06,85.96) 45.95,80.06 45.95,74.12 47.83,72.24 63.7,72.24 65.2,73.74 v1(70.33,73.74) 70.36,73.77
IO5: length 5.6
  Top Layer w0.254: 70.36,78.87 75.9,78.87 75.95,78.92
IO12: length 11.5
  Top Layer w0.254: 44.91,68.38 44.91,71.56 47.09,73.74 52.3,73.74 52.35,73.79
IO13: length 12.9
  Top Layer w0.254: 47.32,68.38 47.32,69.27 47.82,69.77 56.43,69.77 56.9,70.23 56.9,72.29
IO14: length 14.5
  Top Layer w0.254: 52.35,75.04 52.3,74.98 45.8,74.98 42.49,71.68 42.49,68.38
IO15: length 19.4
  Top Layer w0.254: 49.63,68.41 64.77,68.41 65.79,69.42 65.79,72.29
IO17: length 6
  Top Layer w0.254: 75.92,76.66 75.9,76.64 74.07,76.64 73.1,77.6 70.36,77.6
IO18: length 6.1
  Top Layer w0.254: 70.36,80.12 73.13,80.12 74.17,81.16 75.95,81.16 75.97,81.18
IO19: length 6.4
  Top Layer w0.254: 70.38,81.41 72.52,81.41 74.62,83.52 75.92,83.52
IO21: length 6.4
  Top Layer w0.254: 75.92,85.88 75.9,85.86 74.7,85.86 72.77,83.93 70.36,83.93
IO22: length 5.8
  Top Layer w0.254: 70.36,87.74 72.95,87.74 73.58,88.37 75.9,88.37
IO23: length 6.3
  Top Layer w0.254: 75.92,90.91 74.6,90.91 72.69,89.01 70.38,89.01
RTS: length 7
  Top Layer w0.254: 39.75,88.68 39.73,88.7 39.73,89.97 39.27,90.43 37.72,90.43 37.72,91.14 37.34,91.52 35.13,91.52 35.1,91.55
RXD: length 79.4
  Bottom Layer w0.254: v1(70.33,85.22) 72.9,85.22 73.58,84.53 73.58,72.85 72.03,71.3 36.17,71.3 32.79,74.68 32.79,92.08 32.08,92.79 v1(29.11,92.79)
SERVO_01: length 11.2
  Top Layer w0.254: 62.46,43.31 64.54,43.31 70.97,36.88
SERVO_02: length 18.6
  Top Layer w0.254: 73.1,36.88 64.52,45.47 64.52,49.15 62.71,50.96 H5.7
SERVO_03: length 12.3
  Top Layer w0.254: 59.92,43.31 59.92,41.28 62.66,38.54 66.75,38.54 68.4,36.88
SERVO_04: length 20.8
  Top Layer w0.254: 66.32,36.88 62.97,36.88 61.47,38.38 60.48,38.38 58.01,40.85 58.01,49.05 H5.8
SERVO_05: length 7.8
  Top Layer w0.254: 58.24,36.88 55.04,40.08 55.04,43.39
SERVO_06: length 16.4
  Top Layer w0.254: 60.4,36.88 56.74,40.54 56.74,49.33 H6.7
SERVO_07: length 7.9
  Top Layer w0.254: H6.2 52.5,41.35 55.75,38.1 55.75,36.86
SERVO_08: length 16.2
  Top Layer w0.254: H6.8 50.55,49.08 50.55,41.35 53.65,38.26 53.65,36.91
SERVO_09: length 7.5
  Top Layer w0.254: 40,43.41 40,41.13 37.52,38.64 37.52,36.91
SERVO_10: length 15.6
  Top Layer w0.254: 40.06,50.99 41.63,49.42 41.63,38.97 39.55,36.88
SERVO_11: length 8.5
  Top Layer w0.254: 37.47,43.39 35.71,43.39 34.9,42.57 34.9,36.96
SERVO_12: length 17.7
  Top Layer w0.254: 37.41,51.11 34.42,51.11 32.89,49.58 32.89,37.04
SERVO_13: length 7
  Top Layer w0.254: 48.67,36.88 48.67,38.56 47.62,39.6 H8.1
SERVO_14: length 15.5
  Top Layer w0.254: 50.77,36.86 50.77,39.07 49.53,40.31 49.53,49.15 H8.7
SERVO_15: length 7
  Top Layer w0.254: 45.09,43.41 45.09,40.42 46.13,39.37 46.13,36.88
SERVO_16: length 16.8
  Top Layer w0.254: 44.07,36.91 42.6,38.38 42.6,50.35 43.31,51.06 H8.8
SW1: length 2.4
  Top Layer w0.762: 2.54,49.84 2.54,47.45
SW2: length 3.4
  Top Layer w0.762: 50.19,24.95 52.6,22.53
TXD: length 82.3
  Bottom Layer w0.254: 70.36,86.47 73.53,86.47 74.78,85.22 74.78,72.67 72.62,70.51 35.79,70.51 32.03,74.27 32.03,90.61 31.12,91.52 v1(29.11,91.52)
  vias: v1(70.33,86.47)
UD+: length 19.9
  Top Layer w0.254: 19.51,91.39 19.51,93.53 ; 19.51,93.53 18.92,93.53 18.49,93.09 18.49,91.39 ; 19.51,93.53 21.03,95.05 25.02,95.05 26.97,93.09 26.97,89.59 27.58,88.98 29.13,88.98
UD-: length 21.3
  Top Layer w0.254: 19,91.39 19,89.64 19.23,89.41 19.74,89.41 19.99,89.67 19.99,91.39 ; 20.02,91.39 20.02,93.25 21.28,94.52 24.82,94.52 26.49,92.84 26.49,88.85 27.64,87.71 29.11,87.71
$1N584: length 3.1
  Top Layer w0.254: 5.66,45.67 2.54,45.67
$1N915: length 23
  Top Layer w0.254: 8.79,33.56 8.79,31.88 11.66,29.01 14.76,29.01 ; 8.79,33.56 9.65,33.56 10.31,34.22 10.31,42.24 8.25,44.3 8.25,45.67 ; 8.79,33.56 8.76,33.56
$1N926: length 17.3
  Top Layer w0.254: 14.76,31.73 12.8,31.73 11.15,33.38 11.15,42.6 9.5,44.25 9.5,45.67
$1N1045: length 20.1
  Top Layer w0.254: 14.78,34.7 14.78,37.44 13.13,37.44 11.99,38.59 11.99,46.66 8.25,50.4 8.25,51.16
$1N1051: length 2.8
  Top Layer w0.254: 16.59,40.26 16.59,37.44
$1N1135: length 10.8
  Top Layer w0.254: 14.78,43.11 14.78,45.85 14.83,45.9 13.98,45.9 9.53,50.36 9.53,51.18
$1N2594: length 3.5
  Top Layer w0.254: 48.34,24.9 48.34,21.44
$1N2596: length 16.8
  Top Layer w0.254: 36.45,14.81 36.45,17.48 ; 36.45,17.48 36.53,17.4 45.57,17.4 47.07,18.9 48.34,18.9 ; 36.45,17.48 36.45,19.05 R6.1
$1N2597: length 11
  Top Layer w0.254: 39.17,14.81 39.17,15.9 39.68,16.41 45.8,16.41 47.02,17.63 48.31,17.63
$1N2600: length 13.4
  Top Layer w0.254: 42.11,14.79 46.03,14.79 47.78,16.54 51.82,16.54 52.38,17.1 52.38,18.04 53.24,18.9
$1N2601: length 3
  Top Layer w0.254: 44.91,13.01 47.88,13.01
$1N2603: length 8.9
  Top Layer w0.254: 50.65,13.03 50.67,13.01 54.25,13.01 54.91,13.67 54.91,15.4 53.9,16.41 53.9,17.61
$1N3982: length 1.8
  Top Layer w0.254: 37.95,88.68 37.85,88.57 37.85,86.92
$1N4008: length 1.7
  Top Layer w0.254: 37.82,94.06 37.74,93.98 37.74,92.36
$1N4343: length 5.5
  Top Layer w0.254: 20.5,91.39 20.5,85.93
$1N4350: length 5.5
  Top Layer w0.254: 17.5,91.39 17.5,85.88
$1N29279: length 24.7
  Bottom Layer w0.762: 95.94,70.67 91.31,70.67 89.1,72.88 89.1,86.14 86.46,88.78
$1N31260: length 23.1
  Top Layer w0.762: 6.73,78.82 6.73,82.05 ; 6.73,76.43 18.97,76.43 19,76.46 ; 6.68,73.88 6.66,73.86 ; 6.68,73.88 6.68,71.33 ; 6.68,73.88 C40.2 6.71,73.91 6.71,76.43 6.76,76.48 6.76,78.85

## Copper pours and planes (outline as drawn; the poured copper is in the pictures)
3V3 on POWER: 26.62,99.54 99.54,99.54 99.54,43.23 26.62,43.23
5V0 on POWER: 0.26,99.54 49.67,99.54 49.67,0.26 0.26,0.26
5V8A on POWER: 12.85,64.27 49.68,64.27 49.68,35.97 12.85,35.97
5V8B on POWER: 50.42,59.42 99.54,59.42 99.54,0.26 50.42,0.26
GND on Top Layer: -1.91,101.2 101.96,101.2 101.96,-2 -1.91,-2
GND on Bottom Layer: -0.91,100.36 101.14,100.36 101.14,-0.48 -0.91,-0.48
GND on GND: 0.26,99.54 99.54,99.54 99.54,0.26 0.26,0.26
(no net) on Top Layer: 35.81,51.67 35.94,57.79 65.3,58.6 65.3,40.06 35.92,41.28
SW1 on Top Layer: 0.66,63.33 11.56,63.33 13.44,61.45 13.44,57 10.52,54.08 6.81,54.08 6.02,53.29 6.02,49.08 2.69,49.08 0.66,51.11
SW2 on Top Layer: 52.02,22.7 57.91,27.59 65.96,27.59 65.96,21.14 61.72,16.89 61.72,14.94 55.88,14.94 55.7,15.12 55.7,20.86 55.47,21.09 52.02,21.09

Small or netless copper shapes (teardrops, artwork), in the pictures only: 212 on Top Layer, 23 on Bottom Layer, 132 on GND, 72 on POWER

## Text on the board
Bottom Silkscreen Layer: L12 | 5V0 GND | P2 | A4
